# Altium schematic sheet COMS0002_AFSK.SchDoc: BLUEsat AFSK Modem
size A3; DrawnBy: Mitch Wenke, Chris Webb, Thomas Fisk; Engineer: C. WEBB, M. WENKE; Organization: BLUEsat Project; Address1: Room 419; Address2: School of EE&T; Address3: UNSW, NSW 2052; Address4: Australia; DocumentNumber: COMS0002; SheetNumber: 1; SheetTotal: 1; Description: AFSK modem based on CML MX614 IC; Version: 1.0
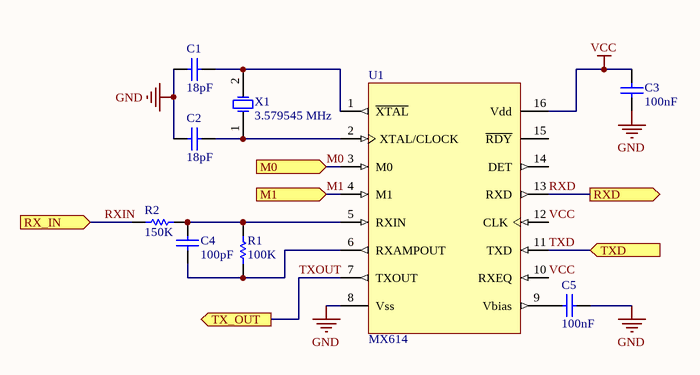
[diagram p0: COMS0002_AFSK.SchDoc]

## Parts
C1  value 18pF  [CAPC2012M]  (hidden comment: Cap)
C2  value 18pF  [CAPC2012M]  (hidden comment: Cap)
C3  value 100nF  [CAPC2012M]  (hidden comment: Cap)
C4  value 100pF  [CAPC2012M]  (hidden comment: Cap)
C5  value 100nF  [CAPC2012M]  (hidden comment: Cap)
R1  value 100K  [RESC2012M]  (hidden comment: Res1)
R2  value 150K  [RESC2012M]  (hidden comment: Res1)
U1  MX614  [SOIC127P1030X270-16N]
X1  3.579545 MHz  [CSM-7]

## Ports
M0 (in), M1 (in), RX_IN (in), RXD (out), TX_OUT (out), TXD (in)

## Nets
GND: C1.1 C2.1 C3.2 C5.1 U1.8(Vss)
VCC: C3.1 U1.10(RXEQ) U1.12(CLK) U1.16(Vdd)
M0: U1.3(M0) ; port M0
M1: U1.4(M1) ; port M1
RXD: U1.13(RXD) ; port RXD
RXIN: R2.1 ; port RX_IN
TXD: U1.11(TXD) ; port TXD
TXOUT: U1.7(TXOUT) ; port TX_OUT
NetC1_2: C1.2 U1.1(~{XTAL}) X1.2(OSC2)
NetC2_2: C2.2 U1.2(XTAL/CLOCK) X1.1(OSC1)
NetC4_1: C4.1 R1.1 U1.6(RXAMPOUT)
NetC4_2: C4.2 R1.2 R2.2 U1.5(RXIN)
NetC5_2: C5.2 U1.9(Vbias)

Not connected (* = marked no-connect by the designer): U1 14(DET) 15(~{RDY})

## Notes on the sheet
- Title
- Description:
- Size:
- Author:
- Date:
- A3
- Time:
- Version
- Sheet:
- Drawing No.:
- of
- File:

## Library data of the parts
C1-C5 = Cap: Capacitor; Published: 8-Jun-2000; LatestRevisionDate: 17-Jul-2002; LatestRevisionNote: Re-released for DXP Platform.; PackageReference: RAD-0.3; Publisher: Altium Limited; Supplier 1: Farnell
  C1-C3 C5: PackageDescription: Radial Cap, Thru-Hole; 2 Leads; 0.3 in Pin Spacing; Supplier Part Number 1: 1759143
  C4: Supplier Part Number 1: 1759203
R1 R2 = Res1: Resistor; Published: 8-Jun-2000; LatestRevisionDate: 17-Jul-2002; LatestRevisionNote: Re-released for DXP Platform.; PackageReference: AXIAL-0.3; Publisher: Altium Limited
  R1: PackageDescription: Axial Device, Thru-Hole; 2 Leads; 0.3 in Pin Spacing; Supplier 1: Farnell; Supplier Part Number 1: 1759143RL; Supplier 2: Farnell; Supplier Part Number 2: 1887334
U1 = MX614: Bell 202 Compatible Modem; Published: 17-Jul-2002; LatestRevisionDate: 04-Mar-2005; LatestRevisionNote: Stylized 3D Model Added.; DatasheetVersion: Nov-2000; PackageVersion: pkg_32, Aug-2005; PackageReference: PDIP16; Publisher: Altium Limited; PackageDescription: DIP; 16 Leads; Row Spacing 7.62 mm; Pitch 2.54 mm; Code_JEDEC: MS-001-BB; ComponentLink1Description: Manufacturer Link; ComponentLink1URL: http://www.latticesemi.com/products/ispPAC/80/index.cfm; ComponentLink2Description: Datasheet; ComponentLink2URL: http://www.latticesemi.com/account/_download.cfm?AMID=1252; ComponentLink3Description: Lattice Login; ComponentLink3URL: http://www.latticesemi.com/account/login.cfm
X1 = ECS-110-S-5P: Crystal Oscillator; Published: 17-Jul-2002; DatasheetDocument: 18-Apr-2000; PackageReference: CSM-7; Publisher: Altium Limited; ComponentLink1Description: Manufacturer Link; ComponentLink1URL: http://www.ecsxtal.com/; ComponentLink2Description: Datasheet; ComponentLink2URL: http://www.ecsxtal.com/pdf3/CSM_7.pdf; Supplier 1: Farnell; Supplier Part Number 1: 1079073